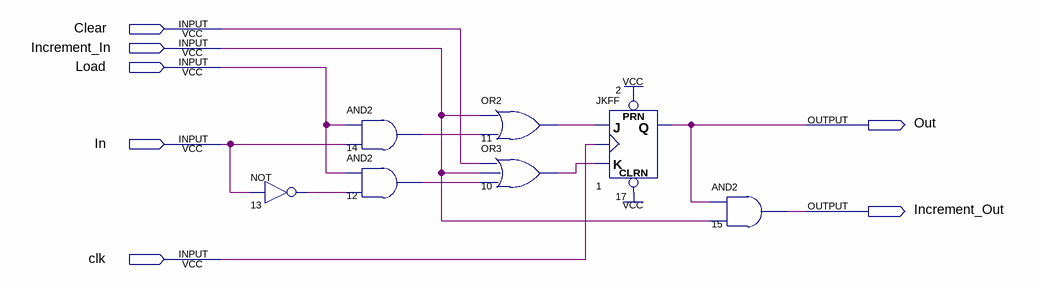
[diagram p0: schematic sheet]
// Quartus schematic counter1bit.bdf as structural Verilog: 7 symbols, 7 pins
module counter1bit (
  input  Clear,
  input  Increment_In,
  input  Load,
  input  In,
  input  clk,
  output Out,
  output Increment_Out
);

  wire n10_out, n11_out, n12_out, n13_out, n14_out;

  not u_13 (n13_out, In);
  and u_14 (n14_out, Load, In);
  and u_12 (n12_out, Load, n13_out);
  or u_11 (n11_out, Increment_In, n14_out);
  or u_10 (n10_out, Clear, Increment_In, n12_out);
  JKFF u_1 (.PRN(1'b1), .CLRN(1'b1), .K(n10_out), .J(n11_out), .CLK(clk), .Q(Out));
  and u_15 (Increment_Out, Out, Increment_In);
endmodule
